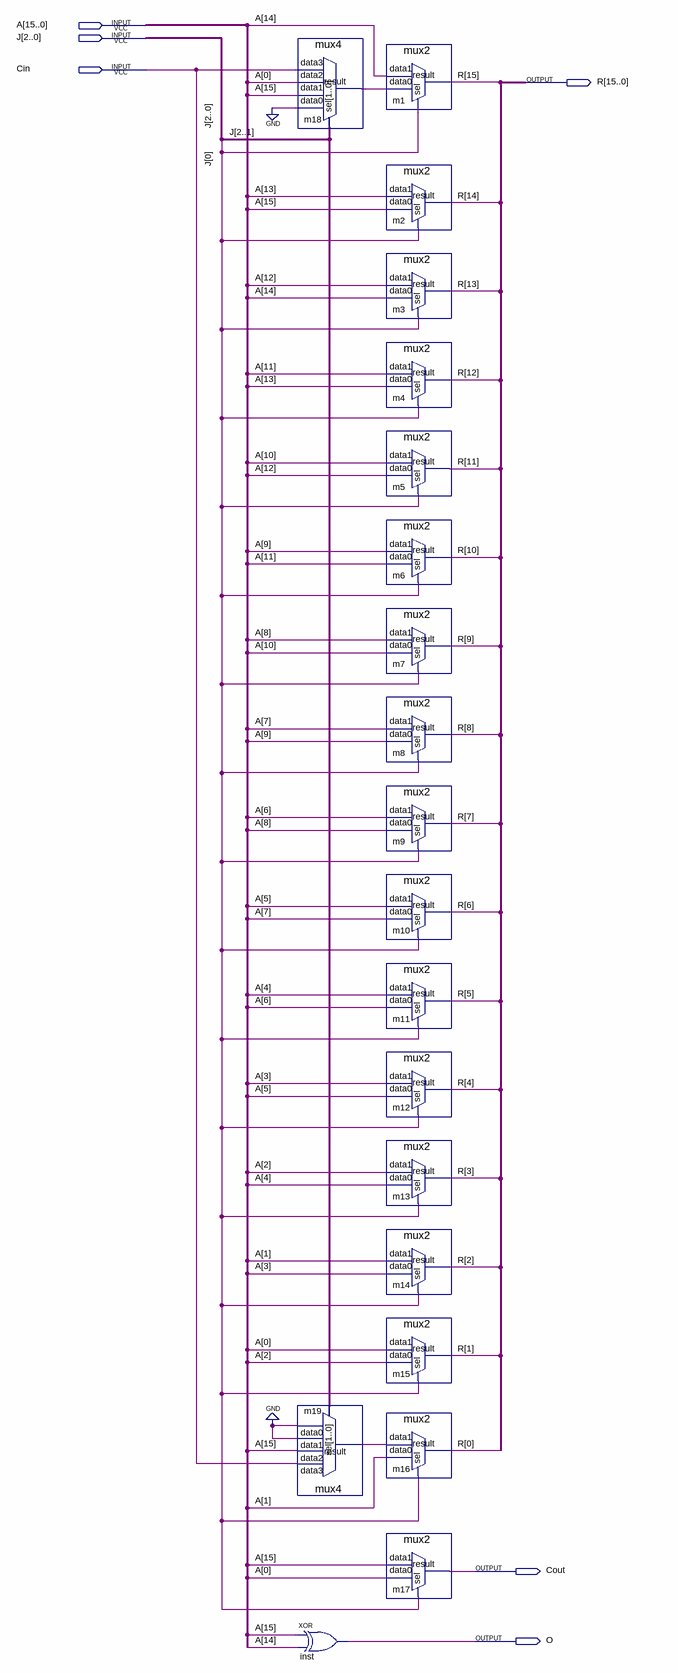
[diagram p0: schematic sheet]
// Quartus schematic shift_unit.bdf as structural Verilog: 20 symbols, 6 pins
module shift_unit (
  input  [15:0] A,
  input  [2:0] J,
  input  Cin,
  output [15:0] R,
  output Cout,
  output O
);

  wire m18_result, m19_result;

  mux4 m18 (.data3(Cin), .data2(A[0]), .data1(A[15]), .data0(1'b0), .sel(J[2:1]), .result(m18_result));
  mux4 m19 (.data3(Cin), .data2(A[15]), .data1(1'b0), .data0(1'b0), .sel(J[2:1]), .result(m19_result));
  xor inst (O, A[15], A[14]);
  mux2 m1 (.data1(A[14]), .data0(m18_result), .sel(J[0]), .result(R[15]));
  mux2 m2 (.data1(A[13]), .data0(A[15]), .sel(J[0]), .result(R[14]));
  mux2 m3 (.data1(A[12]), .data0(A[14]), .sel(J[0]), .result(R[13]));
  mux2 m4 (.data1(A[11]), .data0(A[13]), .sel(J[0]), .result(R[12]));
  mux2 m5 (.data1(A[10]), .data0(A[12]), .sel(J[0]), .result(R[11]));
  mux2 m6 (.data1(A[9]), .data0(A[11]), .sel(J[0]), .result(R[10]));
  mux2 m7 (.data1(A[8]), .data0(A[10]), .sel(J[0]), .result(R[9]));
  mux2 m8 (.data1(A[7]), .data0(A[9]), .sel(J[0]), .result(R[8]));
  mux2 m9 (.data1(A[6]), .data0(A[8]), .sel(J[0]), .result(R[7]));
  mux2 m10 (.data1(A[5]), .data0(A[7]), .sel(J[0]), .result(R[6]));
  mux2 m11 (.data1(A[4]), .data0(A[6]), .sel(J[0]), .result(R[5]));
  mux2 m12 (.data1(A[3]), .data0(A[5]), .sel(J[0]), .result(R[4]));
  mux2 m13 (.data1(A[2]), .data0(A[4]), .sel(J[0]), .result(R[3]));
  mux2 m14 (.data1(A[1]), .data0(A[3]), .sel(J[0]), .result(R[2]));
  mux2 m15 (.data1(A[0]), .data0(A[2]), .sel(J[0]), .result(R[1]));
  mux2 m16 (.data1(m19_result), .data0(A[1]), .sel(J[0]), .result(R[0]));
  mux2 m17 (.data1(A[15]), .data0(A[0]), .sel(J[0]), .result(Cout));
endmodule
